# EAGLE design 7segement4digits1badidea-shield-mk-1 (EAGLE 6.5.0)
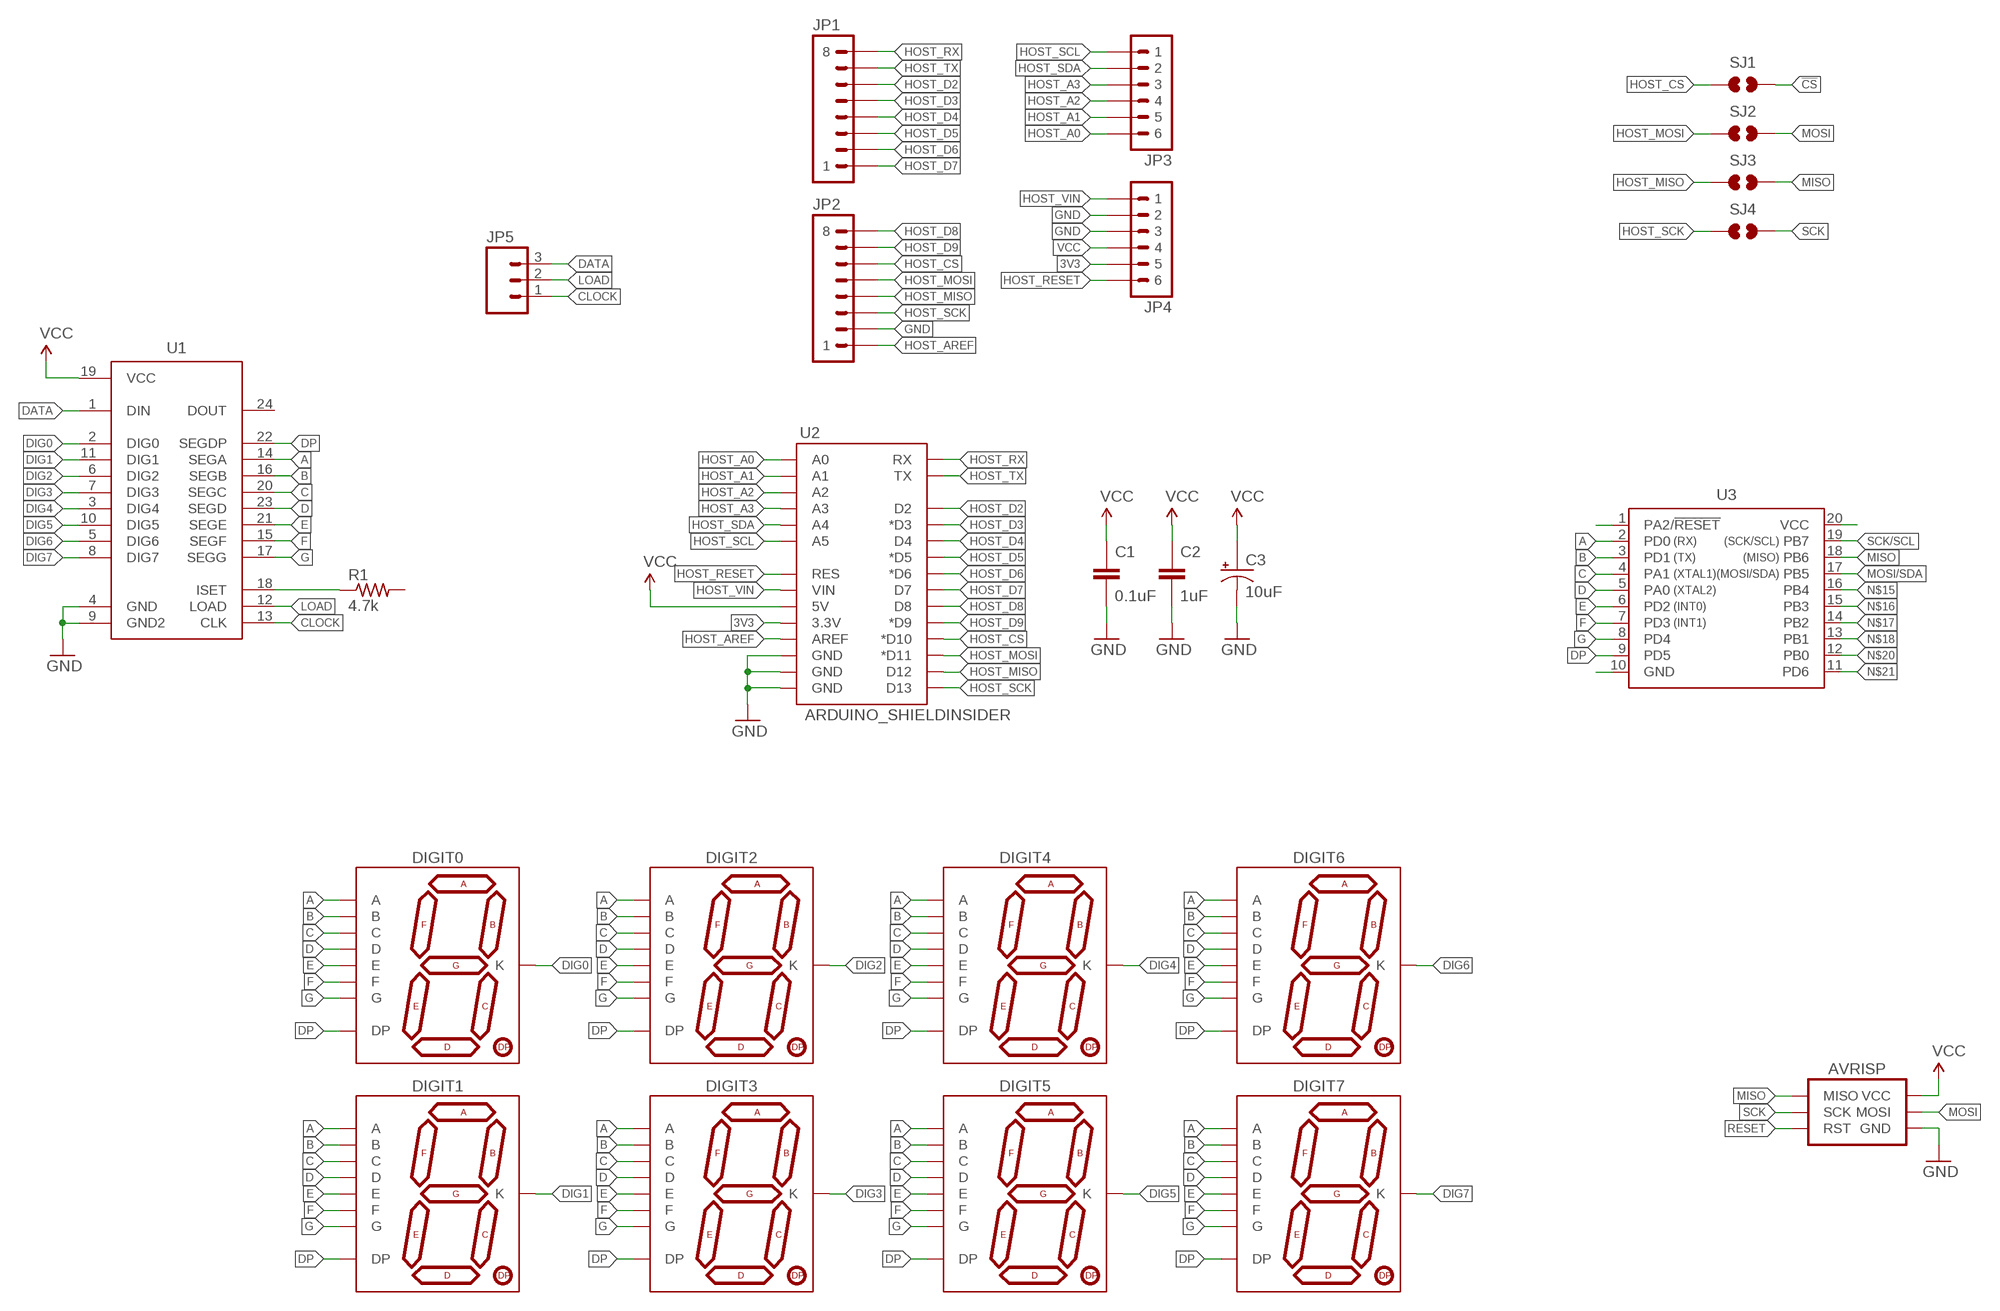
[diagram p0: schematic, sheet 1]

## Parts
AVRISP  AVR_SPI_PRG_6PTH  [2X3]
C1  0.1uF  CAPACITOR-CERAMIC025-024X044  [C025-024X044]
C2  1uF  CAPACITOR-CERAMIC025-024X044  [C025-024X044]
C3  10uF  CAPACITOR-POLARIZEDE2.5-5  [E2,5-5]
DIGIT0  7SEG_1DIGPTH-10MM  [7SEG_1DIG_10MM]
DIGIT1  7SEG_1DIGPTH-10MM  [7SEG_1DIG_10MM]
DIGIT2  7SEG_1DIGPTH-10MM  [7SEG_1DIG_10MM]
DIGIT3  7SEG_1DIGPTH-10MM  [7SEG_1DIG_10MM]
DIGIT4  7SEG_1DIGPTH-10MM  [7SEG_1DIG_10MM]
DIGIT5  7SEG_1DIGPTH-10MM  [7SEG_1DIG_10MM]
DIGIT6  7SEG_1DIGPTH-10MM  [7SEG_1DIG_10MM]
DIGIT7  7SEG_1DIGPTH-10MM  [7SEG_1DIG_10MM]
JP1  M081X08  [1X08]
JP2  M081X08  [1X08]
JP3  M06-NOBS-PTH  [1X06_NOLOCK_FUCKITALL]
JP4  M06-NOBS-PTH  [1X06_NOLOCK_FUCKITALL]
JP5  M03PTH  [1X03]
R1  4.7k  RESISTORPTH-AXIAL-6.35MM  [RESISTOR-AXIAL-PTH-6.35MM]
SJ1  JUMPER-PAD-2-NOYES_SILK  [PAD-JUMPER-2-NO_YES_SILK]
SJ2  JUMPER-PAD-2-NOYES_SILK  [PAD-JUMPER-2-NO_YES_SILK]
SJ3  JUMPER-PAD-2-NOYES_SILK  [PAD-JUMPER-2-NO_YES_SILK]
SJ4  JUMPER-PAD-2-NOYES_SILK  [PAD-JUMPER-2-NO_YES_SILK]
U1  MAX7219DIP  [DIL24]
U2  ARDUINO_SHIELDINSIDER  [ARDUINO_SHIELD_NOOUTLINE_INSIDE]
U3  ATTINY2313ADIP  [DIL20]

## Nets
3V3: JP4.5 U2.3.3V
!CS: SJ1.2
A: DIGIT0.10(A) DIGIT1.10(A) DIGIT2.10(A) DIGIT3.10(A) DIGIT4.10(A) DIGIT5.10(A) DIGIT6.10(A) DIGIT7.10(A) U1.14(SEGA) U3.2(PD0)
B: DIGIT0.9(B) DIGIT1.9(B) DIGIT2.9(B) DIGIT3.9(B) DIGIT4.9(B) DIGIT5.9(B) DIGIT6.9(B) DIGIT7.9(B) U1.16(SEGB) U3.3(PD1)
C: DIGIT0.8(C) DIGIT1.8(C) DIGIT2.8(C) DIGIT3.8(C) DIGIT4.8(C) DIGIT5.8(C) DIGIT6.8(C) DIGIT7.8(C) U1.20(SEGC) U3.4(PA1)
CLOCK: JP5.1 U1.13(CLK)
D: DIGIT0.5(D) DIGIT1.5(D) DIGIT2.5(D) DIGIT3.5(D) DIGIT4.5(D) DIGIT5.5(D) DIGIT6.5(D) DIGIT7.5(D) U1.23(SEGD) U3.5(PA0)
DATA: JP5.3 U1.1(DIN)
DIG0: DIGIT0.1(K) DIGIT0.6(K) U1.2(DIG0)
DIG1: DIGIT1.1(K) DIGIT1.6(K) U1.11(DIG1)
DIG2: DIGIT2.1(K) DIGIT2.6(K) U1.6(DIG2)
DIG3: DIGIT3.1(K) DIGIT3.6(K) U1.7(DIG3)
DIG4: DIGIT4.1(K) DIGIT4.6(K) U1.3(DIG4)
DIG5: DIGIT5.1(K) DIGIT5.6(K) U1.10(DIG5)
DIG6: DIGIT6.1(K) DIGIT6.6(K) U1.5(DIG6)
DIG7: DIGIT7.1(K) DIGIT7.6(K) U1.8(DIG7)
DP: DIGIT0.7(DP) DIGIT1.7(DP) DIGIT2.7(DP) DIGIT3.7(DP) DIGIT4.7(DP) DIGIT5.7(DP) DIGIT6.7(DP) DIGIT7.7(DP) U1.22(SEGDP) U3.9(PD5)
E: DIGIT0.4(E) DIGIT1.4(E) DIGIT2.4(E) DIGIT3.4(E) DIGIT4.4(E) DIGIT5.4(E) DIGIT6.4(E) DIGIT7.4(E) U1.21(SEGE) U3.6(PD2)
F: DIGIT0.2(F) DIGIT1.2(F) DIGIT2.2(F) DIGIT3.2(F) DIGIT4.2(F) DIGIT5.2(F) DIGIT6.2(F) DIGIT7.2(F) U1.15(SEGF) U3.7(PD3)
G: DIGIT0.3(G) DIGIT1.3(G) DIGIT2.3(G) DIGIT3.3(G) DIGIT4.3(G) DIGIT5.3(G) DIGIT6.3(G) DIGIT7.3(G) U1.17(SEGG) U3.8(PD4)
GND: AVRISP.6(GND) C1.2 C2.2 C3.- JP2.2 JP4.2 JP4.3 U1.4(GND) U1.9(GND2) U2.GND@0(GND) U2.GND@1(GND) U2.GND@2(GND)
HOST_A0: JP3.6 U2.A0
HOST_A1: JP3.5 U2.A1
HOST_A2: JP3.4 U2.A2
HOST_A3: JP3.3 U2.A3
HOST_AREF: JP2.1 U2.AREF
HOST_CS: JP2.6 SJ1.1 U2.D10(*D10)
HOST_D2: JP1.6 U2.D2
HOST_D3: JP1.5 U2.D3(*D3)
HOST_D4: JP1.4 U2.D4
HOST_D5: JP1.3 U2.D5(*D5)
HOST_D6: JP1.2 U2.D6(*D6)
HOST_D7: JP1.1 U2.D7
HOST_D8: JP2.8 U2.D8
HOST_D9: JP2.7 U2.D9(*D9)
HOST_MISO: JP2.4 SJ3.1 U2.D12
HOST_MOSI: JP2.5 SJ2.1 U2.D11(*D11)
HOST_RESET: JP4.6 U2.RES
HOST_RX: JP1.8 U2.RX
HOST_SCK: JP2.3 SJ4.1 U2.D13
HOST_SCL: JP3.1 U2.A5
HOST_SDA: JP3.2 U2.A4
HOST_TX: JP1.7 U2.TX
HOST_VIN: JP4.1 U2.VIN
LOAD: JP5.2 U1.12(LOAD)
MISO: AVRISP.1(MISO) SJ3.2 U3.18(PB6)
MOSI: AVRISP.4(MOSI) SJ2.2
MOSI/SDA: U3.17(PB5)
N$1: U3.1(PA2/!RESET)
N$10: U3.10(GND)
N$11: U3.20(VCC)
N$15: U3.16(PB4)
N$16: U3.15(PB3)
N$17: U3.14(PB2)
N$18: U3.13(PB1)
N$19: R1.P$1 U1.18(ISET)
N$20: U3.12(PB0)
N$21: U3.11(PD6)
RESET: AVRISP.5(RST)
SCK: AVRISP.3(SCK) SJ4.2
SCK/SCL: U3.19(PB7)
VCC: AVRISP.2(VCC) C1.1 C2.1 C3.+ JP4.4 U1.19(VCC) U2.5V
Unconnected: R1.P$2 U1.24(DOUT)

## Library data of the parts
AVRISP = A_butts:AVR_SPI_PRG_6: AVR ISP 6 Pin This is the reduced ISP connector for AVR programming. Common on Arduino. This footprint will take up less PCB space and can be used with a 10-pin to 6-pin adapter such as SKU: BOB-08508 **Special note about "TEST_POINT" package. The stop mask is on the top side, so if you want your programming test points to be on the bottom of your board, make sure to place this package on the bottom side of the board. This also ensure that the orientation to program from the bottom side will be correct.
C1 C2 = A_butts:CAPACITOR-CERAMIC: CAPACITOR, European symbol
C3 = A_butts:CAPACITOR-POLARIZED: POLARIZED CAPACITOR, American symbol
DIGIT0 DIGIT1-DIGIT7 = A_butts:7SEG_1DIG
JP1 JP2 = A_butts:M08: Header 8 Standard 8-pin 0.1" header. Use with straight break away headers (SKU : PRT-00116), right angle break away headers (PRT-00553), swiss pins (PRT-00743), machine pins (PRT-00117), and female headers (PRT-00115).
JP3 JP4 = A_butts:M06: Header 6 Standard 6-pin 0.1" header. Use with straight break away headers (SKU : PRT-00116), right angle break away headers (PRT-00553), swiss pins (PRT-00743), machine pins (PRT-00117), and female headers (PRT-00115). Molex polarized connector foot print use with SKU : PRT-08094 with associated crimp pins and housings. NOTES ON THE VARIANTS LOCK and LOCK_LONGPADS... This footprint was designed to help hold the alignment of a through-hole component (i.e. 6-pin header) while soldering it into place. You may notice that each hole has been shifted either up or down by 0.005 of an inch from it's more standard position (which is a perfectly straight line). This slight alteration caused the pins (the squares in the middle) to touch the edges of the holes. Because they are alternating, it causes a "brace" to hold the component in place. 0.005 has proven to be the perfect amount of "off-center" position when using our standard breakaway headers. Although looks a little odd when you look at the bare footprint, once you have a header in there, the alteration is very hard to notice. Also,if you push a header all the way into place, it is covered up entirely on the bottom side. This idea of altering the position of holes to aid alignment will be further integrated into the Sparkfun Library for other footprints. It can help hold any component with 3 or more connection pins.
JP5 = A_butts:M03: Header 3 Standard 3-pin 0.1" header. Use with straight break away headers (SKU : PRT-00116), right angle break away headers (PRT-00553), swiss pins (PRT-00743), machine pins (PRT-00117), and female headers (PRT-00115). Molex polarized connector foot print use with SKU : PRT-08232 with associated crimp pins and housings.
R1 = A_butts:RESISTOR: RESISTOR, American symbol
SJ1-SJ4 = A_butts:JUMPER-PAD-2-NO
U1 = A_butts:MAX7219: 8-digit, 8-segment LED display driver, serial input
U2 = A_butts:ARDUINO_SHIELD: Arduino shield footprint
U3 = A_butts:ATTINY2313A: ATTINY2313A 2kB 20MHz I2C/SPI/UART

## Board
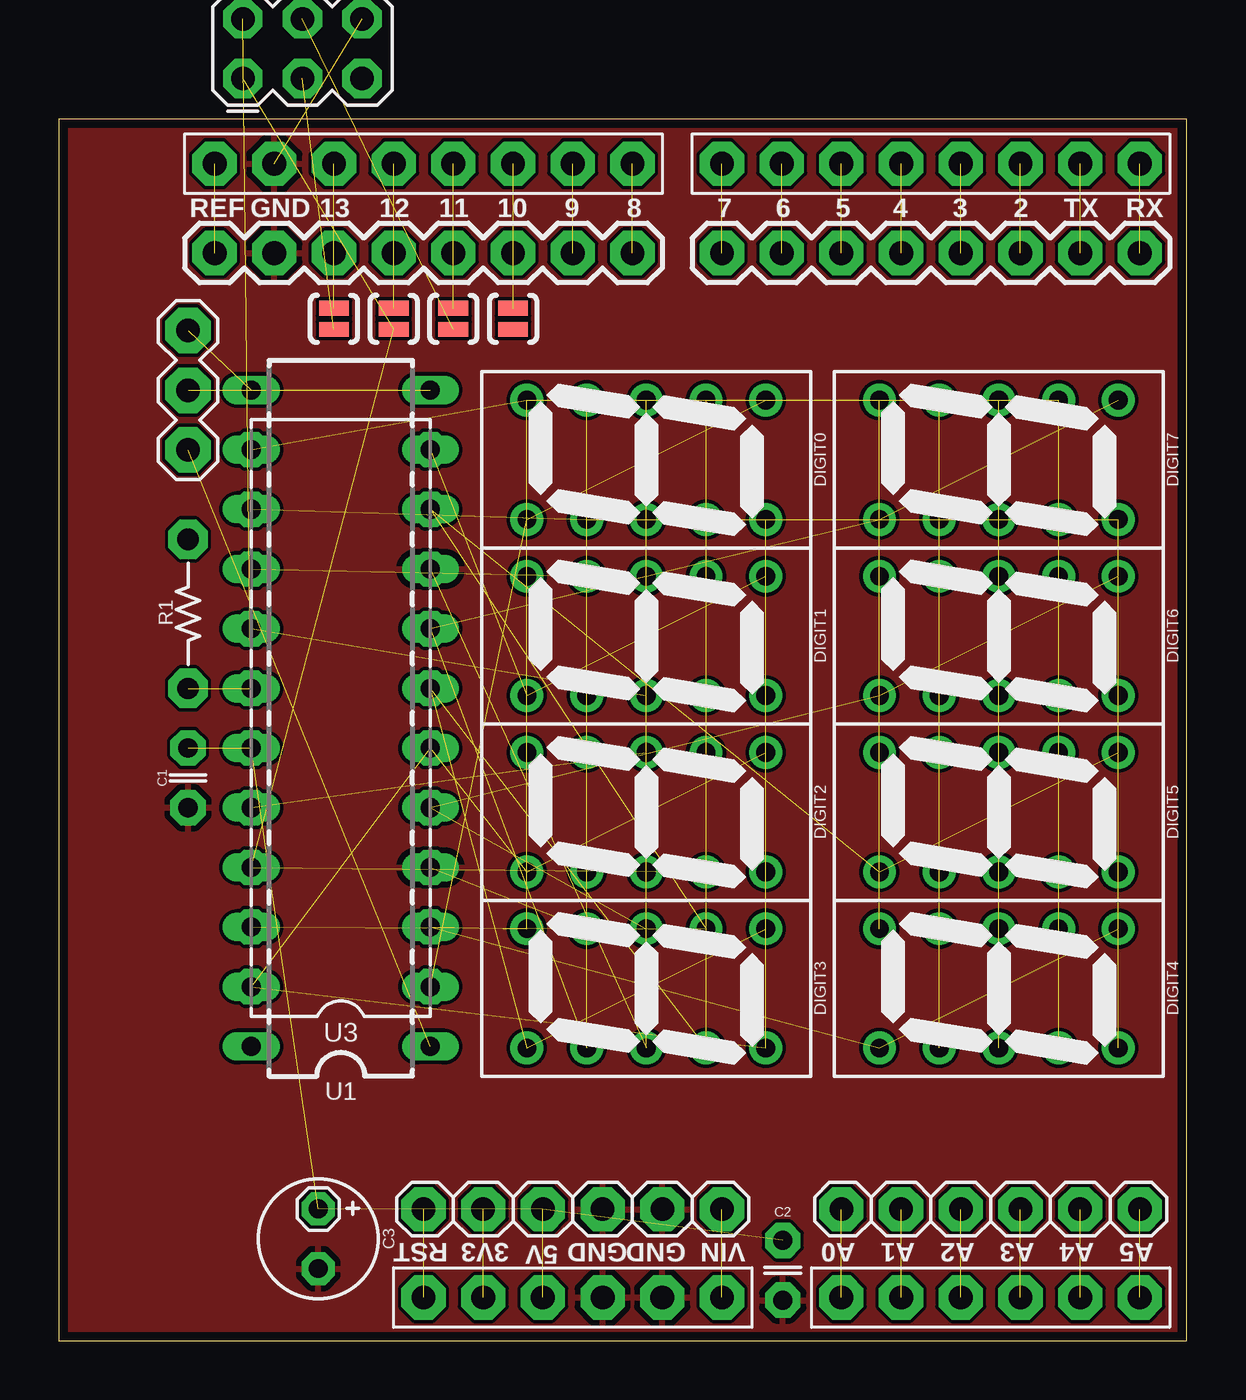
[diagram p1: board, top side]

Size 48 x 52 mm. Coordinates in mm from the lower left corner, seen from the top.
Outline: 0,52 0,0 48,0 48,52 0,52
Copper layers (1*16): Top 0.0356mm / dielectric 1.5011mm / Bottom 0.0356mm
Design rules "LaenPCBOrder_2": minimum track width 6mil, minimum drill 13mil, track to track 6mil, track to pad 6mil, pad to pad 6mil, via to via 6mil, smd to smd 6mil, copper to edge 15mil, drill to drill 6mil, minimum pad ring 7mil, minimum via ring 7mil, stop-mask expansion 3mil, vias tented up to drill 20mil, thermal gap 10mil

### Footprints (pad centres in the part's own frame; a part is rotated, then mirrored left to right if it is on the bottom)
2X3 = drill 1 pad 1.676 octagon: 1 -2.54,-1.27; 2 -2.54,1.27; 3 0,-1.27; 4 0,1.27; 5 2.54,-1.27; 6 2.54,1.27
C025-024X044 = drill 0.813 pad 1.5 octagon: 1 -1.27,0; 2 1.27,0
E2,5-5 = drill 0.8 pad 1.4 octagon: + -1.27,0; - 1.27,0
7SEG_1DIG_10MM = drill 0.8 pad 1.4: 1 -2.54,5.08; 2 -2.54,2.54; 3 -2.54,0; 4 -2.54,-2.54; 5 -2.54,-5.08; 6 2.54,-5.08; 7 2.54,-2.54; 8 2.54,0; 9 2.54,2.54; 10 2.54,5.08
1X08 = drill 1.016 pad 1.88 octagon: 1 0,0; 2 2.54,0; 3 5.08,0; 4 7.62,0; 5 10.16,0; 6 12.7,0; 7 15.24,0; 8 17.78,0
1X06_NOLOCK_FUCKITALL = drill 1 pad 1.88 octagon: 1 0,0; 2 2.54,0; 3 5.08,0; 4 7.62,0; 5 10.16,0; 6 12.7,0
1X03 = drill 1 pad 1.93 octagon: 1 0,0; 2 2.54,0; 3 5.08,0
RESISTOR-AXIAL-PTH-6.35MM = drill 0.9 pad 1.676 octagon: P$1 -3.175,0; P$2 3.175,0
PAD-JUMPER-2-NO_YES_SILK = smd 0.635 x 1.27: 1 -0.45,0; 2 0.45,0
DIL24 = drill 0.813 long: 1 -13.97,-3.81; 2 -11.43,-3.81; 3 -8.89,-3.81; 4 -6.35,-3.81; 5 -3.81,-3.81; 6 -1.27,-3.81; 7 1.27,-3.81; 8 3.81,-3.81; 9 6.35,-3.81; 10 8.89,-3.81; 11 11.43,-3.81; 12 13.97,-3.81; 13 13.97,3.81; 14 11.43,3.81; 15 8.89,3.81; 16 6.35,3.81; 17 3.81,3.81; 18 1.27,3.81; 19 -1.27,3.81; 20 -3.81,3.81; 21 -6.35,3.81; 22 -8.89,3.81; 23 -11.43,3.81; 24 -13.97,3.81
ARDUINO_SHIELD_NOOUTLINE_INSIDE = drill 1.016 pad 1.88 octagon: 3.3V 48.26,-27.94; 5V 48.26,-25.4; A0 48.26,-12.7; A1 48.26,-10.16; A2 48.26,-7.62; A3 48.26,-5.08; A4 48.26,-2.54; A5 48.26,0; AREF 0,-39.37; D2 0,-5.08; D3 0,-7.62; D4 0,-10.16; D5 0,-12.7; D6 0,-15.24; D7 0,-17.78; D8 0,-21.59; D9 0,-24.13; D10 0,-26.67; D11 0,-29.21; D12 0,-31.75; D13 0,-34.29; GND@0 48.26,-22.86; GND@1 48.26,-20.32; GND@2 0,-36.83; RES 48.26,-30.48; RX 0,0; TX 0,-2.54; VIN 48.26,-17.78
DIL20 = drill 0.8 pad 1.5 octagon: 1 -11.43,-3.81; 2 -8.89,-3.81; 3 -6.35,-3.81; 4 -3.81,-3.81; 5 -1.27,-3.81; 6 1.27,-3.81; 7 3.81,-3.81; 8 6.35,-3.81; 9 8.89,-3.81; 10 11.43,-3.81; 11 11.43,3.81; 12 8.89,3.81; 13 6.35,3.81; 14 3.81,3.81; 15 1.27,3.81; 16 -1.27,3.81; 17 -3.81,3.81; 18 -6.35,3.81; 19 -8.89,3.81; 20 -11.43,3.81

### Placement (x,y rotation side)
AVRISP  10.37,55 0 top
C1  5.5,23.96 270 top
C2  30.81,3 270 top
C3  11.04,4.34 270 top
DIGIT0  25,37.5 90 top
DIGIT1  25,30 90 top
DIGIT2  25,22.5 90 top
DIGIT3  25,15 90 top
DIGIT4  40,15 90 top
DIGIT5  40,22.5 90 top
DIGIT6  40,30 90 top
DIGIT7  40,37.5 90 top
JP1  28.22,46.3 0 top
JP2  6.63,46.3 0 top
JP3  46,5.6 180 top
JP4  28.22,5.6 180 top
JP5  5.5,43 270 top
R1  5.5,30.94 90 top
SJ1  19.33,43.5 270 top
SJ2  16.79,43.5 270 top
SJ3  14.25,43.5 270 top
SJ4  11.71,43.5 270 top
U1  12,26.5 90 top
U2  46,50.1 270 top
U3  12,26.5 90 top

### Tracks (layer width: path | path; a pad name or v marks a point on that pad's centre or on a via)
3V3  (1 unrouted)
A  (9 unrouted)
B  (9 unrouted)
C  (9 unrouted)
CLOCK  (1 unrouted)
D  (9 unrouted)
DATA  (1 unrouted)
DIG0  (2 unrouted)
DIG1  (2 unrouted)
DIG2  (2 unrouted)
DIG3  (2 unrouted)
DIG4  (2 unrouted)
DIG5  (2 unrouted)
DIG6  (2 unrouted)
DIG7  (2 unrouted)
DP  (9 unrouted)
E  (9 unrouted)
F  (9 unrouted)
G  (9 unrouted)
GND  (1 unrouted)
  pour Top: 0,52 48,52 48,0 0,0
HOST_A0  (1 unrouted)
HOST_A1  (1 unrouted)
HOST_A2  (1 unrouted)
HOST_A3  (1 unrouted)
HOST_AREF  (1 unrouted)
HOST_CS  (2 unrouted)
HOST_D2  (1 unrouted)
HOST_D3  (1 unrouted)
HOST_D4  (1 unrouted)
HOST_D5  (1 unrouted)
HOST_D6  (1 unrouted)
HOST_D7  (1 unrouted)
HOST_D8  (1 unrouted)
HOST_D9  (1 unrouted)
HOST_MISO  (2 unrouted)
HOST_MOSI  (2 unrouted)
HOST_RESET  (1 unrouted)
HOST_RX  (1 unrouted)
HOST_SCK  (2 unrouted)
HOST_SCL  (1 unrouted)
HOST_SDA  (1 unrouted)
HOST_TX  (1 unrouted)
HOST_VIN  (1 unrouted)
LOAD  (1 unrouted)
MISO  (2 unrouted)
MOSI  (1 unrouted)
N$19  (1 unrouted)
SCK  (1 unrouted)
VCC  (6 unrouted)